# Altium schematic sheet irf540触发V2_0.SchDoc
size A4
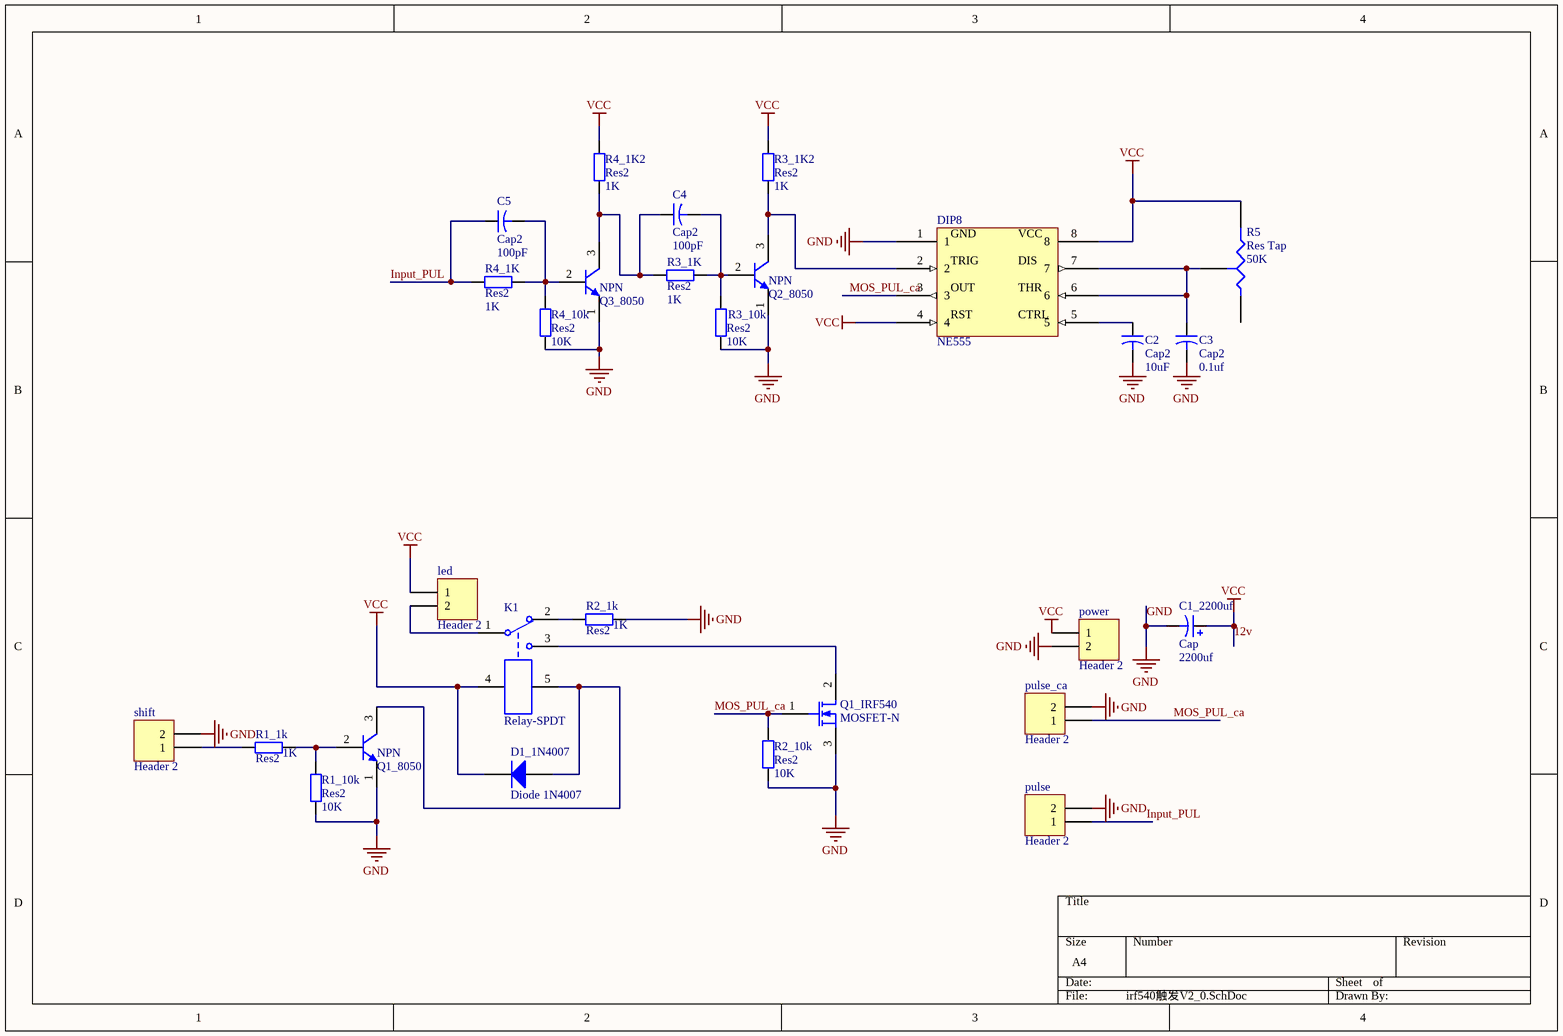
[diagram p0: irf540触发V2_0.SchDoc]

## Parts
C1_2200uf  Cap  value 2200uf  [RB7.6-15]
C2  Cap2  value 10uF  [CAPR5-4X5]
C3  Cap2  value 0.1uf  [CAPR5-4X5]
C4  Cap2  value 100pF  [CAPR5-4X5]
C5  Cap2  value 100pF  [CAPR5-4X5]
D1_1N4007  Diode 1N4007  [DO-41]
DIP8  NE555  [DIP8]
K1  Relay-SPDT  [RELAY_SDR]
led  Header 2  [HDR1X2]
power  Header 2  [HDR1X2]
pulse  Header 2  [HDR1X2]
pulse_ca  Header 2  [HDR1X2]
Q1_8050  NPN  [TO-226-AA]
Q1_IRF540  MOSFET-N  [PCBComponent_1]
Q2_8050  NPN  [TO-226-AA]
Q3_8050  NPN  [TO-226-AA]
R1_1k  Res2  value 1K  [AXIAL-0.4]
R1_10k  Res2  value 10K  [AXIAL-0.4]
R2_1k  Res2  value 1K  [AXIAL-0.4]
R2_10k  Res2  value 10K  [AXIAL-0.4]
R3_1K  Res2  value 1K  [AXIAL-0.4]
R3_1K2  Res2  value 1K  [AXIAL-0.4]
R3_10k  Res2  value 10K  [AXIAL-0.4]
R4_1K  Res2  value 1K  [AXIAL-0.4]
R4_1K2  Res2  value 1K  [AXIAL-0.4]
R4_10k  Res2  value 10K  [AXIAL-0.4]
R5  Res Tap  value 50K  [VR5]
shift  Header 2  [HDR1X2]

## Nets
12v: C1_2200uf.1 D1_1N4007.2(K) DIP8.4 DIP8.8 K1.4 led.1 power.1 R3_1K2.1 R4_1K2.1 R5.2(B)  [also labelled VCC]
GND: C1_2200uf.2 C2.2 C3.2 DIP8.1 power.2 pulse.2 pulse_ca.2 Q1_8050.1(E) Q1_IRF540.3(S) Q2_8050.1(E) Q3_8050.1(E) R1_10k.1 R2_1k.2 R2_10k.1 R3_10k.1 R4_10k.1 shift.2
Input_PUL: C5.1 pulse.1 R4_1K.2
MOS_PUL_ca: DIP8.3 pulse_ca.1 Q1_IRF540.1(G) R2_10k.2
NetC2_1: C2.1 DIP8.5
NetC3_1: C3.1 DIP8.6 DIP8.7 R5.3(TAP)
NetC4_1: C4.1 Q3_8050.3(C) R3_1K.2 R4_1K2.2
NetC4_2: C4.2 Q2_8050.2(B) R3_1K.1 R3_10k.2
NetC5_2: C5.2 Q3_8050.2(B) R4_1K.1 R4_10k.2
NetD1_1N4007_1: D1_1N4007.1(A) K1.5 Q1_8050.3(C)
NetDIP8_2: DIP8.2 Q2_8050.3(C) R3_1K2.2
NetK1_1: K1.1 led.2
NetK1_2: K1.2 R2_1k.1
NetK1_3: K1.3 Q1_IRF540.2(D)
NetQ1_8050_2: Q1_8050.2(B) R1_1k.2 R1_10k.2
NetR1_1k_1: R1_1k.1 shift.1

Not connected (* = marked no-connect by the designer): R5 1(A)

## Notes on the sheet
- (in symbol NE555) GND; VCC; TRIG; DIS; OUT; THR; RST; CTRL

## Library data of the parts
C1_2200uf = Cap Pol1: Polarized Capacitor (Radial); Published: 8-Jun-2000; LatestRevisionDate: 17-Jul-2002; LatestRevisionNote: Re-released for DXP Platform.; PackageReference: RB7.6-15; Publisher: Altium Limited; PackageDescription: Polarized Capacitor (Radial); 2 Leads
C2-C5 = Cap2: Capacitor; Published: 23-Sep-2002; PackageReference: CAPR5-4X5; Publisher: Altium Limited; PackageDescription: Capacitor; 2 Leads
D1_1N4007 = Diode 1N4007: 1 Amp General Purpose Rectifier; Published: 8-Jun-2000; LatestRevisionDate: 17-Jul-2002; LatestRevisionNote: Re-released for DXP Platform.; DatasheetVersion: 1998; PackageVersion: Aug-1999; PackageReference: DO-41; Publisher: Altium Limited; PackageDescription: Diode, Axial; Body 5.2 x 2.7 mm (LxDia. max), Lead Dia. 0.86 mm (max); Code_JEDEC: DO-204-AL; ComponentLink1Description: Manufacturer Link; ComponentLink1URL: http://www.fairchildsemi.com/; ComponentLink2Description: Datasheet; ComponentLink2URL: http://www.fairchildsemi.com/ds/1N%2F1N4001.pdf
K1 = Relay-SPDT: Single-Pole Dual-Throw Relay; Published: 24-Mar-1999; LatestRevisionDate: 17-Jul-2002; LatestRevisionNote: Re-released for DXP Platform.; PackageReference: MODULE5B; Publisher: Altium Limited
led power pulse pulse_ca shift = Header 2: Header, 2-Pin; LatestRevisionDate: 17-Jul-2002; LatestRevisionNote: Re-released for DXP Platform.; Publisher: Altium Limited
Q1_8050 Q2_8050 Q3_8050 = NPN: NPN Bipolar Transistor; Published: 8-Jun-2000; LatestRevisionDate: 17-Jul-2002; LatestRevisionNote: Re-released for DXP Platform.; PackageReference: TO-226-AA; Publisher: Altium Limited; PackageDescription: TO, Flat Index; 3 In-Line, Axial Leads; Body Dia. 4.8mm; Leads 0.55 x 0.51 mm (max); Code_JEDEC: TO-226-AA
Q1_IRF540 = MOSFET-N: N-Channel MOSFET; Published: 8-Jun-2000; LatestRevisionDate: 17-Jul-2002; LatestRevisionNote: Re-released for DXP Platform.; PackageVersion: 1995/1996; PackageReference: E3; Publisher: Altium Limited; PackageDescription: TO, Flat Index; 3 In-Line, Axial Leads; Body Dia. 4.6mm; Lead Dia. 0.5 mm (max)
R1_1k R1_10k R2_1k R2_10k R3_1K R3_1K2 R3_10k R4_1K R4_1K2 R4_10k = Res2: Resistor; Published: 8-Jun-2000; LatestRevisionDate: 17-Jul-2002; LatestRevisionNote: Re-released for DXP Platform.; PackageReference: AXIAL-0.4; Publisher: Altium Limited; PackageDescription: Axial Device, Thru-Hole; 2 Leads; 0.4 in Pin Spacing
R5 = Res Tap: Tapped Resistor; Sim Note: Enter the Resistance value and the set point into parameter fields.; Set Position: 0.5; Published: 24-Mar-1999; LatestRevisionDate: 17-Jul-2002; LatestRevisionNote: Re-released for DXP Platform.; PackageReference: VR3; Publisher: Altium Limited; PackageDescription: Variable Resistor, Thru-Hole; 3 Leads